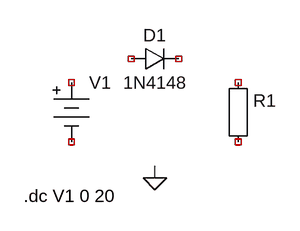
[diagram p0: schematic diode-va-draft.asc]
diode-va-draft.asc, the LTspice schematic file:
Version 4
SHEET 1 880 680
WIRE 48 368 48 352
FLAG 48 368 0
SYMBOL diode 16 224 R270
WINDOW 0 32 32 VTop 2
WINDOW 3 0 32 VBottom 2
SYMATTR InstName D1
SYMATTR Value 1N4148
SYMBOL Misc\\EuropeanResistor 144 224 R0
SYMATTR InstName R1
SYMATTR Value ""
SYMBOL Misc\\battery -64 224 R0
WINDOW 123 0 0 Left 2
WINDOW 39 0 0 Left 2
SYMATTR InstName V1
SYMATTR Value ""
TEXT -128 392 Left 2 !.dc V1 0 20

The netlist it stands for:
* diode-va-draft.asc
D1 NC_01 NC_02 1N4148
R1 NC_03 NC_04
V1 NC_05 NC_06
.model D D
.lib standard.dio
.dc V1 0 20
.backanno
.end